# EAGLE design TCM8230MD (EAGLE 5.11)
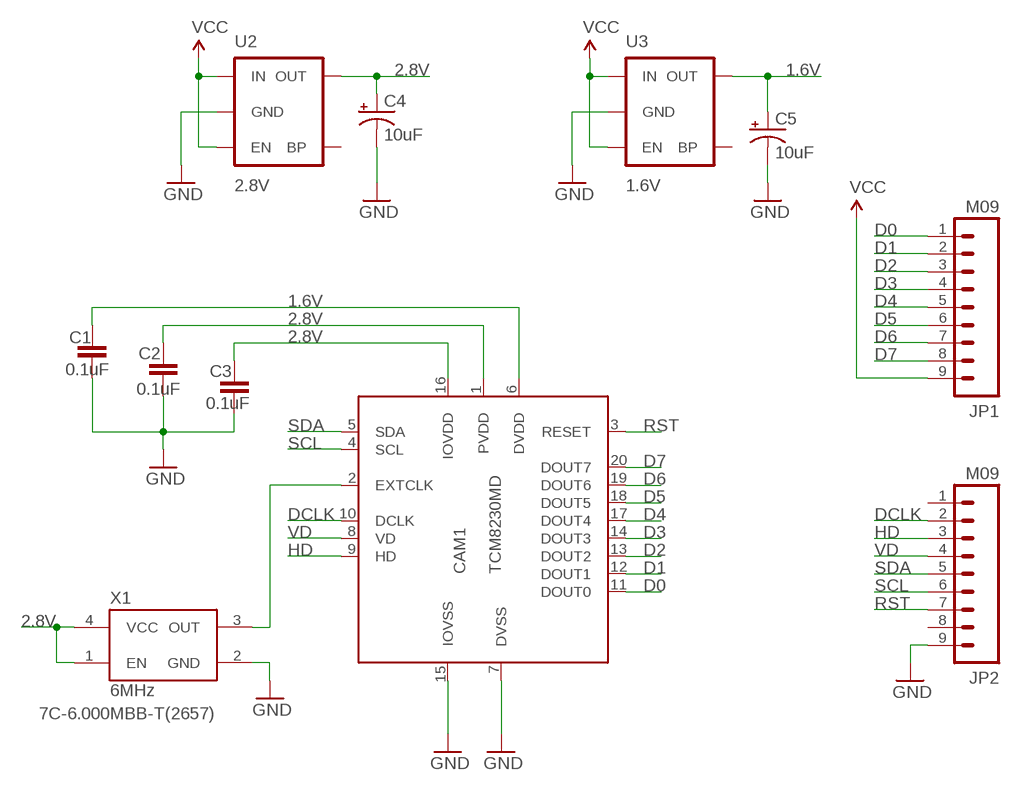
[diagram p0: schematic, sheet 1]

## Parts
C1  0.1uF  CAP0402-CAP  [0402-CAP]
C2  0.1uF  CAP0402-CAP  [0402-CAP]
C3  0.1uF  CAP0402-CAP  [0402-CAP]
C4  10uF  CAP_POL1206  [EIA3216]
C5  10uF  CAP_POL1206  [EIA3216]
CAM1  TCM8230MD  [TCM8230MD]
JP1  M09  [1X09]
JP2  M09  [1X09]
U2  2.8V  V_REG_LDOSMD  [SOT23-5]
U3  1.6V  V_REG_LDOSMD  [SOT23-5]
X1  6MHz  OSCILLATOR5X3-PIN1-INDICATED  [CRYSTAL-OSC-SMD-5X3]

## Nets
1.6V: C1.1 C5.A(+) CAM1.6(DVDD) U3.5(OUT)
2.8V: C2.1 C3.1 C4.A(+) CAM1.1(PVDD) CAM1.16(IOVDD) U2.5(OUT) X1.1(EN) X1.4(VCC)
D0: CAM1.11(DOUT0) JP1.1
D1: CAM1.12(DOUT1) JP1.2
D2: CAM1.13(DOUT2) JP1.3
D3: CAM1.14(DOUT3) JP1.4
D4: CAM1.17(DOUT4) JP1.5
D5: CAM1.18(DOUT5) JP1.6
D6: CAM1.19(DOUT6) JP1.7
D7: CAM1.20(DOUT7) JP1.8
DCLK: CAM1.10(DCLK) JP2.2
GND: C1.2 C2.2 C3.2 C4.C(-) C5.C(-) CAM1.7(DVSS) CAM1.15(IOVSS) JP2.9 U2.2(GND) U3.2(GND) X1.2(GND)
HD: CAM1.9(HD) JP2.3
N$1: CAM1.2(EXTCLK) X1.3(OUT)
RST: CAM1.3(RESET) JP2.7
SCL: CAM1.4(SCL) JP2.6
SDA: CAM1.5(SDA) JP2.5
VCC: JP1.9 U2.1(IN) U2.3(EN) U3.1(IN) U3.3(EN)
VD: CAM1.8(VD) JP2.4
Unconnected: JP2.1 JP2.8 U2.4(BP) U3.4(BP)

## Notes on the sheet
- 7C-6.000MBB-T(2657)

## Library data of the parts
C1-C3 = SparkFun:CAP: Capacitor Standard 0603 ceramic capacitor, and 0.1" leaded capacitor.
C4 C5 = SparkFun:CAP_POL: Capacitor Polarized These are standard SMD and PTH capacitors. Normally 10uF, 47uF, and 100uF in electrolytic and tantalum varieties. Always verify the external diameter of the through hole cap, it varies with capacity, voltage, and manufacturer. The EIA devices should be standard.
CAM1 = tcm82x0md:TCM8230MD: TCM8240MD 0.3 Mega pixel sensor chip mfg TOSHIBA symbol/package by Kyrre Aalerud Note: Chip has pads for socket mounting on underside. Do not route anything under the chip unless you insulate it.
JP1 JP2 = SparkFun:M09: Header 9 Standard 9-pin 0.1" header. Use with straight break away headers (SKU : PRT-00116), right angle break away headers (PRT-00553), swiss pins (PRT-00743), machine pins (PRT-00117), and female headers (PRT-00115).
U2 U3 = SparkFun:V_REG_LDO: Voltage Regulator LDO Standard 150mA LDO voltage regulator in SOT-23 layout. Micrel part MIC5205. BP (by-pass) pin is used to lower output noise with 470pF cap.
X1 = SparkFun:OSCILLATOR

## Board
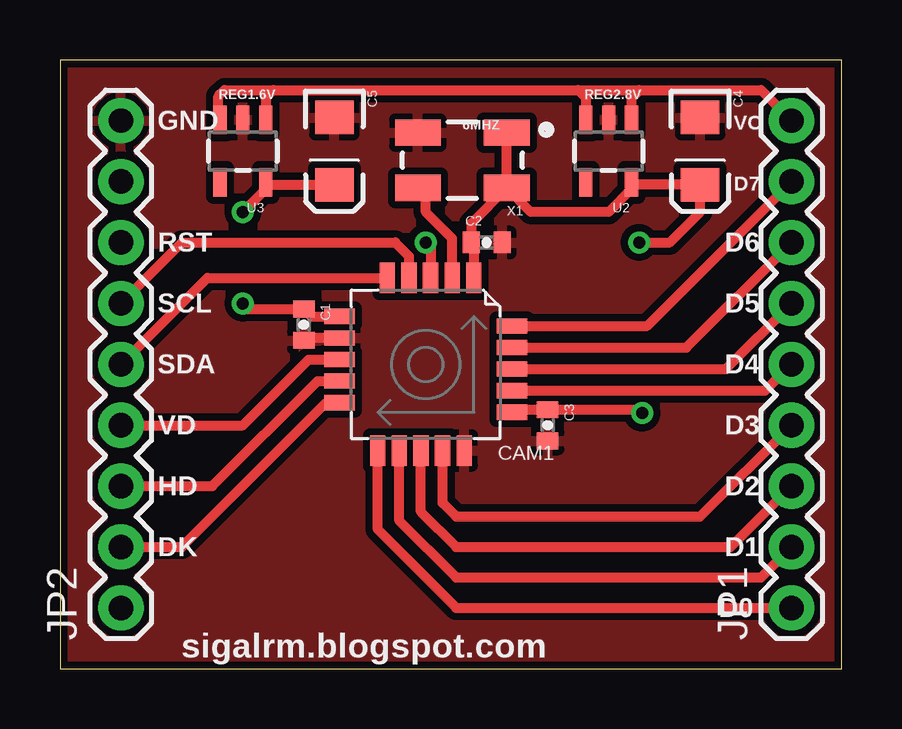
[diagram p1: board, top side]
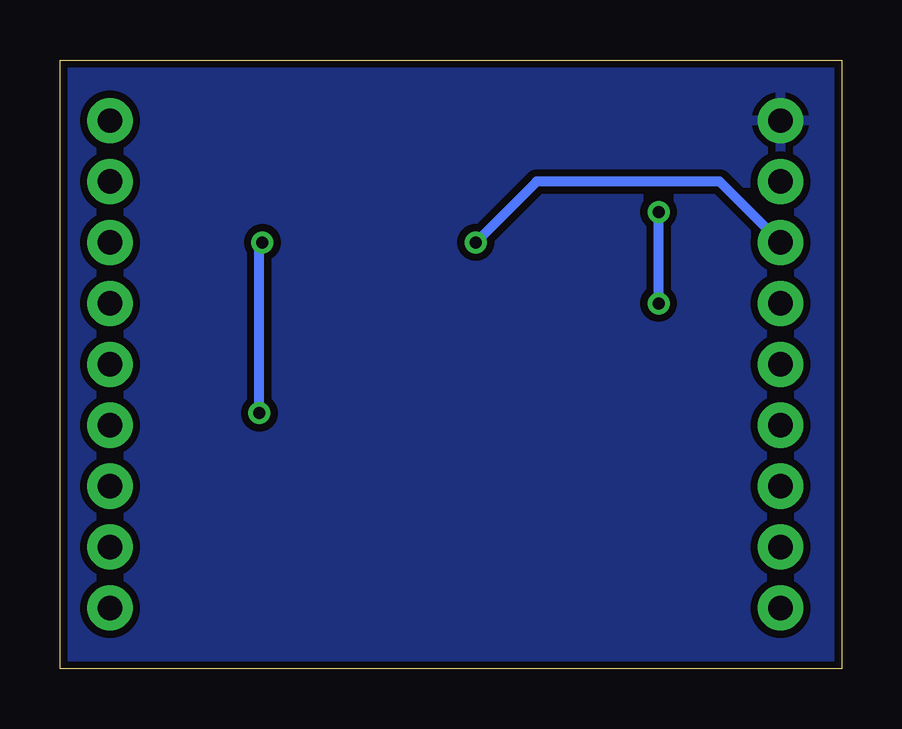
[diagram p2: board, bottom side, seen from below]

Size 32.56 x 25.39 mm. Coordinates in mm from the lower left corner, seen from the top.
Outline: 0,0 32.56,0 32.56,25.39 0,25.39 0,0
Copper layers (1*16): Top 0.035mm / dielectric 1.5mm / Bottom 0.035mm
Design rules "default *": minimum track width 10mil, minimum drill 20mil, track to track 8mil, track to pad 8mil, pad to pad 8mil, via to via 8mil, smd to smd 8mil, copper to edge 8mil, drill to drill 8mil, minimum pad ring 10mil, minimum via ring 8mil, stop-mask expansion 4mil, vias tented up to drill 0mil, thermal gap 10mil

### Footprints (pad centres in the part's own frame; a part is rotated, then mirrored left to right if it is on the bottom)
0402-CAP = smd 0.7 x 0.9: 1 -0.65,0; 2 0.65,0
EIA3216 = smd 1.4 x 1.6: A 1.4,0; C -1.4,0
TCM8230MD = smd 0.635 x 1.27: 1 2,3.6; 2 1.1,3.6; 3 0.2,3.6; 4 -0.7,3.6; 5 -1.6,3.6; 11 -2,-3.6; 12 -1.1,-3.6; 13 -0.2,-3.6; 14 0.7,-3.6; 15 1.6,-3.6 | smd 1.27 x 0.635: 6 -3.6,2; 7 -3.6,1.1; 8 -3.6,0.2; 9 -3.6,-0.7; 10 -3.6,-1.6; 16 3.6,-2; 17 3.6,-1.1; 18 3.6,-0.2; 19 3.6,0.7; 20 3.6,1.6
1X09 = drill 1.016 pad 1.88 round: 1 0,0; 2 2.54,0; 3 5.08,0; 4 7.62,0; 5 10.16,0; 6 12.7,0; 7 15.24,0; 8 17.78,0; 9 20.32,0
SOT23-5 = smd 0.55 x 1.2: 1 -0.95,-1.3; 2 0,-1.3; 3 0.95,-1.3; 4 0.95,1.3; 5 -0.95,1.3
CRYSTAL-OSC-SMD-5X3 = smd 1.9 x 1.1: 1 -1.85,-1.15; 2 1.85,-1.15; 3 1.85,1.15; 4 -1.85,1.15

### Placement (x,y rotation side)
C1  10.16,14.35 270 top
C2  17.78,17.78 0 top
C3  20.32,10.16 270 top
C4  26.67,21.59 270 top
C5  11.43,21.59 270 top
CAM1  15.24,12.7 0 top
JP1  30.48,2.54 90 top
JP2  2.54,2.54 90 top
U2  22.86,21.59 180 top
U3  7.62,21.59 180 top
X1  16.76,21.21 180 top

### Tracks (layer width: path | path; a pad name or v marks a point on that pad's centre or on a via)
1.6V  (via drill 0.51)
  Top 0.406: C5.A 8.67,20.19 U3.5 8.57,20 v7.62,19.05 | v7.62,15.24 7.86,15 C1.1 10.46,14.7 CAM1.6
  Bottom 0.406: v7.62,15.24 v7.62,19.05
2.8V  (via drill 0.51)
  Top 0.406: v24.13,17.78 25.4,17.78 26.67,19.05 C4.A 23.91,20.19 U2.5 23.81,20 22.86,19.05 19.62,19.05 X1.4 | X1.4 X1.1 | CAM1.16 18.95,10.81 C3.1 24.11,10.81 v24.26,10.67 | CAM1.1 17.24,17.67 C2.1 17.13,18.57 X1.4
  Bottom 0.406: v24.26,10.67 24.26,17.65 v24.13,17.78
D0
  Top 0.406: CAM1.11 13.24,5.81 16.51,2.54 JP1.1
D1
  Top 0.406: CAM1.12 14.14,6.18 16.51,3.81 29.21,3.81 JP1.2
D2
  Top 0.406: CAM1.13 15.04,6.55 16.51,5.08 27.94,5.08 JP1.3
D3
  Top 0.406: CAM1.14 15.94,6.92 16.51,6.35 26.67,6.35 JP1.4
D4
  Top 0.406: CAM1.17 29.38,11.6 JP1.5
D5
  Top 0.406: CAM1.18 27.74,12.5 JP1.6
D6
  Top 0.406: CAM1.19 26.1,13.4 JP1.7
D7
  Top 0.406: CAM1.20 24.46,14.3 JP1.8
DCLK
  Top 0.406: CAM1.10 11.1,11.1 5.08,5.08 JP2.2
GND
  Top 0.406: CAM1.7 10.26,13.8 C1.2
  pour Top (isolate 0.305): 0,25.4 32.56,25.38 32.57,0 0,0
  pour Bottom (isolate 0.305): 0,25.4 32.56,25.39 32.57,0 0,0
HD
  Top 0.406: CAM1.9 10.73,12 6.35,7.62 JP2.3
N$1
  Top 0.406: CAM1.2 16.34,17.95 15.24,19.05 15.24,19.73 X1.3
RST  (via drill 0.51)
  Top 0.406: CAM1.3 15.44,17.58 v15.24,17.78
  Bottom 0.406: v15.24,17.78 12.7,20.32 5.08,20.32 JP2.7
SCL
  Top 0.406: CAM1.4 14.54,17.21 13.97,17.78 5.08,17.78 JP2.6
SDA
  Top 0.406: CAM1.5 6.14,16.3 JP2.5
VCC
  Top 0.406: JP1.9 29.21,24.13 24.13,24.13 | 8.89,24.13 6.86,24.13 6.6,23.88 6.6,22.96 U3.3 | 8.89,24.13 21.59,24.13 | 21.59,24.13 24.13,24.13 | U3.1 8.57,23.81 8.89,24.13 | U2.1 23.81,23.81 24.13,24.13 | U2.3 21.91,23.81 21.59,24.13
VD
  Top 0.406: CAM1.8 10.36,12.9 7.62,10.16 JP2.4

### Text on the board
tPlace: REG1.6V | REG2.8V | GND | 6MHZ | VC | D7 | RST | D6 | SCL | D5 | SDA | D4 | VD | D3 | HD | D2 | DK | D1 | D0 | sigalrm.blogspot.com